# EAGLE schematic Motor_Drivers (EAGLE 8.6.1)
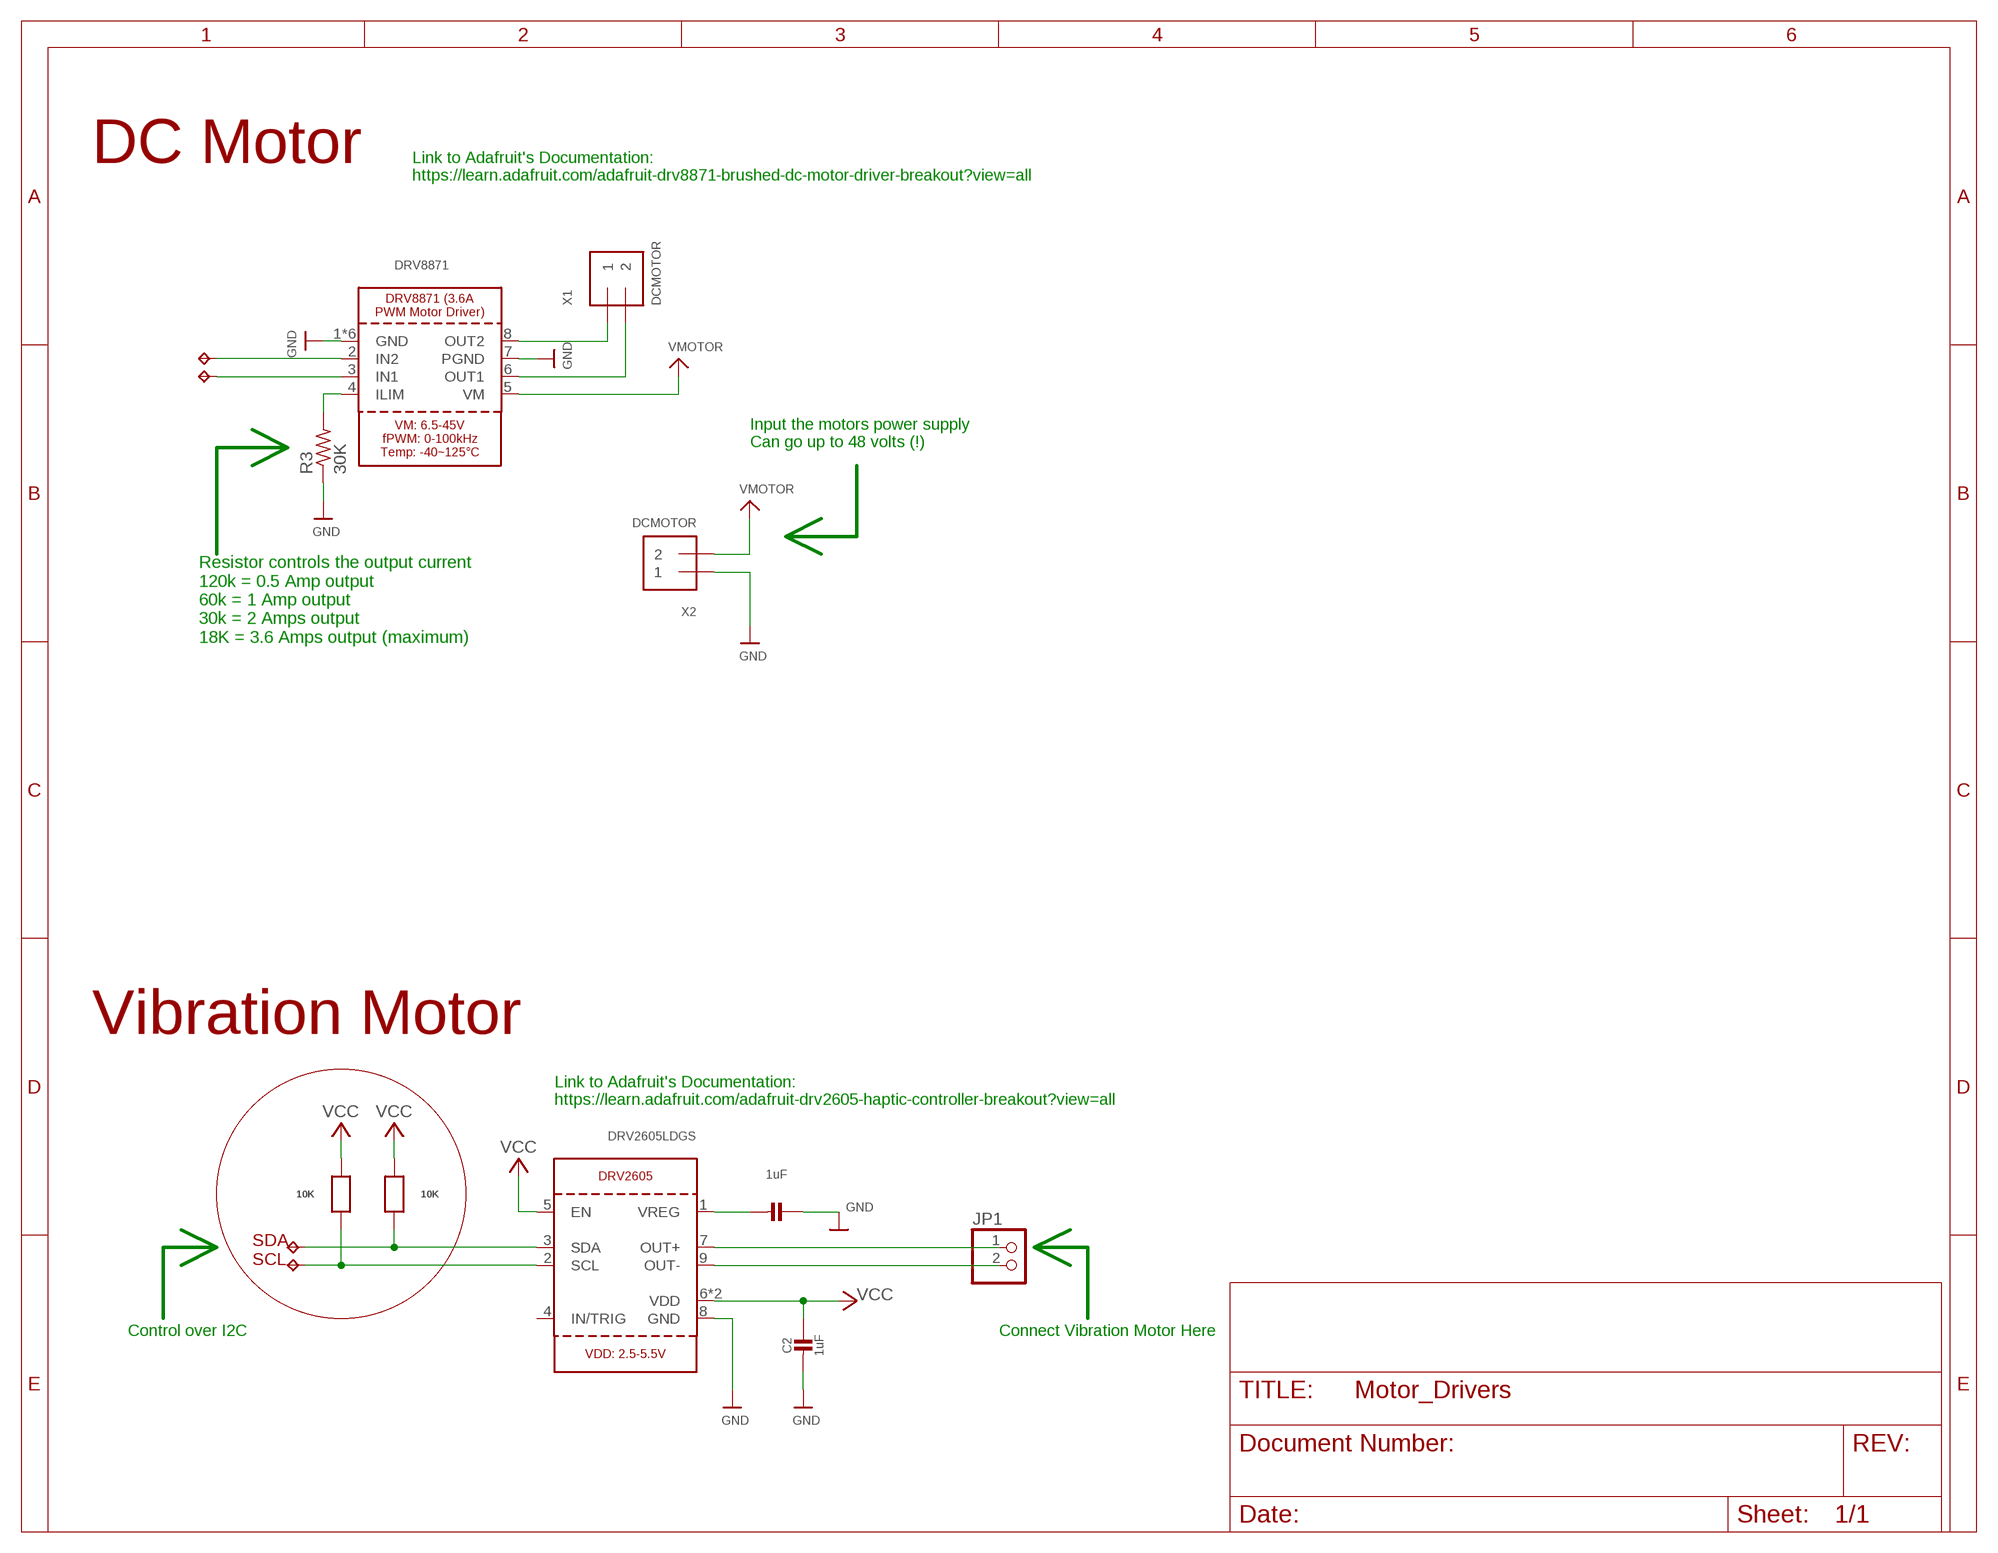
[diagram p0: schematic, sheet 1]

## Parts
C1  1uF  CAP_CERAMIC0805-NOOUTLINE  [0805-NO]
C2  1uF  CAP_CERAMIC0805-NOOUTLINE  [0805-NO]
JP1  PINHD-1X2  [1X02]
R1  10K  RESISTOR0805_NOOUTLINE  [0805-NO@1]
R2  10K  RESISTOR0805_NOOUTLINE  [0805-NO@1]
R3  30K  FLIPFLOP-RES  [0805-THM]
TP1  TPTP20R  [TP20R]
TP2  TPTP20R  [TP20R]
TP3  TPTP20R  [TP20R]
TP4  TPTP20R  [TP20R]
U1  DRV2605LDGS  DRV2605_SOP  [PSOP10]
U2  DRV8871  [HSOP8]
X1  DCMOTOR  TERMBLOCK_1X2  [TERMBLOCK_1X2-3.5MM]
X2  DCMOTOR  TERMBLOCK_1X2  [TERMBLOCK_1X2-3.5MM]

## Nets
GND: C1.1 C2.2 R3.1 U1.8(GND) U2.1(GND) U2.7(PGND) U2.GND U2.P$1(GND) U2.P$2(GND) U2.P$3(GND) U2.P$4(GND) X2.1
N$1: R1.1 TP1.TP U1.3(SDA)
N$2: R2.1 TP2.TP U1.2(SCL)
N$5: C1.2 U1.1(VREG)
N$6: R3.2 U2.4(ILIM)
N$7: TP3.TP U2.2(IN2)
N$8: TP4.TP U2.3(IN1)
OUT1: U2.6(OUT1) X1.2
OUT2: U2.8(OUT2) X1.1
OUT+: JP1.1 U1.7(OUT+)
OUT-: JP1.2 U1.9(OUT-)
VCC: C2.1 R1.2 R2.2 U1.5(EN) U1.6(VDD) U1.10(VDD)
VMOTOR: U2.5(VM) X2.2
Unconnected: U1.4(IN/TRIG)

## Notes on the sheet
- DC Motor
- Link to Adafruit's Documentation:
  https://learn.adafruit.com/adafruit-drv8871-brushed-dc-motor-driver-breakout?view=all
- Input the motors power supply
  Can go up to 48 volts (!)
- Resistor controls the output current
  120k = 0.5 Amp output
  60k = 1 Amp output
  30k = 2 Amps output
  18K = 3.6 Amps output (maximum)
- Vibration Motor
- Link to Adafruit's Documentation:
  https://learn.adafruit.com/adafruit-drv2605-haptic-controller-breakout?view=all
- SDA
  SCL
- Control over I2C | Connect Vibration Motor Here

## Library data of the parts
C1 C2 = microbuilder:CAP_CERAMIC: Ceramic Capacitors For new designs, use the packages preceded by an '_' character since they are more reliable: The following footprints should be used on most boards: _0402 - Standard footprint for regular board layouts _0603 - Standard footprint for regular board layouts _0805 - Standard footprint for regular board layouts _1206 - Standard footprint for regular board layouts For extremely tight-pitch boards where space is at a premium, the following 'micro-pitch' footprints can be used (smaller pads, no silkscreen outline, etc.): _0402MP - Micro-pitch footprint for very dense/compact boards _0603MP - Micro-pitch footprint for very dense/compact boards _0805MP - Micro-pitch footprint for very dense/compact boards _1206MP - Micro-pitch footprint for very dense/compact boards
JP1 = pinhead:PINHD-1X2: PIN HEADER
R1 R2 = microbuilder:RESISTOR: Resistors For new designs, use the packages preceded by an '_' character since they are more reliable: The following footprints should be used on most boards: _0402 - Standard footprint for regular board layouts _0603 - Standard footprint for regular board layouts _0805 - Standard footprint for regular board layouts _1206 - Standard footprint for regular board layouts For extremely tight-pitch boards where space is at a premium, the following 'micro-pitch' footprints can be used (smaller pads, no silkscreen outline, etc.): _0402MP - Micro-pitch footprint for very dense/compact boards _0603MP - Micro-pitch footprint for very dense/compact boards _0805MP - Micro-pitch footprint for very dense/compact boards _1206MP - Micro-pitch footprint for very dense/compact boards
R3 = adafruit:FLIPFLOP-RES: Flip Flop resistor An 0805 resistor inside a standard 1/4W 5% resistor. Makes for easy mods
TP1-TP4 = testpad:TP: Test pad
U1 = microbuilder:DRV2605: DRV2605 - Haptic Driver for ERM/LRA Motors
U2 = microbuilder:DRV8871: DRV8871 - 3.6A PWM Motor Driver
X1 X2 = microbuilder:TERMBLOCK_1X2: 3.5mm Terminal block http://www.ladyada.net/library/pcb/eaglelibrary.html